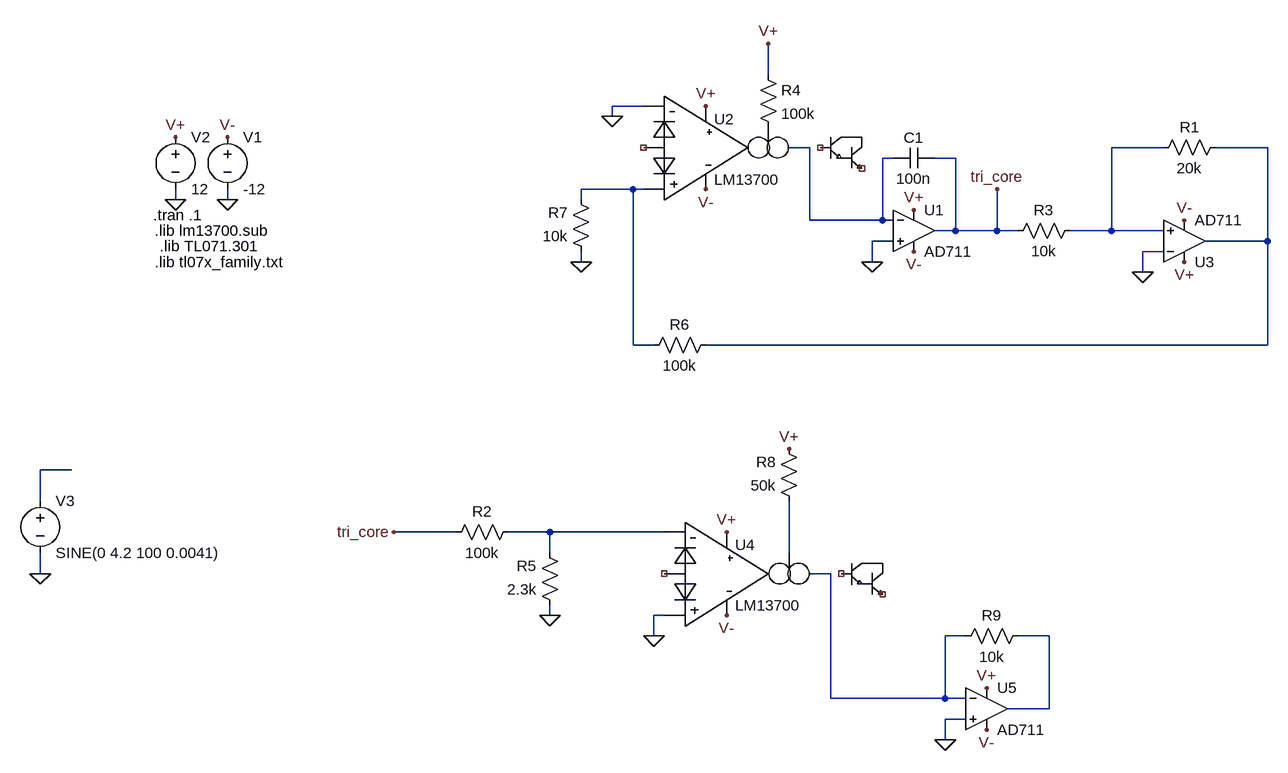
[diagram p0: schematic osc_core.asc]
osc_core.asc, the LTspice schematic file:
Version 4
SHEET 1 1972 1108
WIRE -208 -16 -208 -64
WIRE -400 32 -448 32
WIRE -448 48 -448 32
WIRE -144 96 -176 96
WIRE 400 96 320 96
WIRE 560 96 480 96
WIRE -16 112 -32 112
WIRE 80 112 48 112
WIRE -416 160 -496 160
WIRE -400 160 -416 160
WIRE -1120 176 -1120 160
WIRE -1040 176 -1040 160
WIRE -496 176 -496 160
WIRE -144 208 -144 96
WIRE -32 208 -32 112
WIRE -32 208 -144 208
WIRE -16 208 -32 208
WIRE 80 224 80 112
WIRE 80 224 48 224
WIRE 144 224 144 160
WIRE 144 224 80 224
WIRE 176 224 144 224
WIRE 320 224 320 96
WIRE 320 224 256 224
WIRE 400 224 320 224
WIRE -16 240 -48 240
WIRE 560 240 560 96
WIRE 560 240 464 240
WIRE 400 256 368 256
WIRE -496 272 -496 256
WIRE -48 272 -48 240
WIRE 368 288 368 256
WIRE -416 400 -416 160
WIRE -384 400 -416 400
WIRE 560 400 560 240
WIRE 560 400 -304 400
WIRE -1280 592 -1328 592
WIRE -1328 640 -1328 592
WIRE -688 688 -784 688
WIRE -544 688 -608 688
WIRE -368 688 -544 688
WIRE -544 720 -544 688
WIRE -176 720 -176 640
WIRE -1328 752 -1328 720
WIRE -112 752 -144 752
WIRE -544 816 -544 800
WIRE -368 816 -384 816
WIRE -384 848 -384 816
WIRE 96 848 64 848
WIRE 224 848 176 848
WIRE -112 944 -112 752
WIRE 64 944 64 848
WIRE 64 944 -112 944
WIRE 96 944 64 944
WIRE 224 960 224 848
WIRE 224 960 160 960
WIRE 96 976 64 976
WIRE 64 1008 64 976
FLAG -1040 176 0
FLAG -1120 176 0
FLAG -1120 80 V+
FLAG 432 272 V+
FLAG -1040 80 V-
FLAG 432 208 V-
FLAG -208 -64 V+
FLAG -304 32 V+
FLAG -304 160 V-
FLAG -448 48 0
FLAG 368 288 0
FLAG 16 192 V+
FLAG 16 256 V-
FLAG -48 272 0
FLAG -496 272 0
FLAG 144 160 tri_core
FLAG -784 688 tri_core
FLAG -384 848 0
FLAG -544 816 0
FLAG -176 560 V+
FLAG -272 816 V-
FLAG -272 688 V+
FLAG 128 992 V-
FLAG 128 928 V+
FLAG 64 1008 0
FLAG -1328 752 0
SYMBOL voltage -1040 64 R0
WINDOW 123 0 0 Left 0
WINDOW 39 0 0 Left 0
SYMATTR InstName V1
SYMATTR Value -12
SYMBOL voltage -1120 64 R0
WINDOW 123 0 0 Left 0
WINDOW 39 0 0 Left 0
SYMATTR InstName V2
SYMATTR Value 12
SYMBOL LM13700 -336 16 R0
SYMATTR InstName U2
SYMBOL res -224 -32 R0
SYMATTR InstName R4
SYMATTR Value 100k
SYMBOL res 496 80 R90
WINDOW 0 0 56 VBottom 2
WINDOW 3 32 56 VTop 2
SYMATTR InstName R1
SYMATTR Value 20k
SYMBOL cap 48 96 R90
WINDOW 0 0 32 VBottom 2
WINDOW 3 32 32 VTop 2
SYMATTR InstName C1
SYMATTR Value 100n
SYMBOL res 272 208 R90
WINDOW 0 0 56 VBottom 2
WINDOW 3 32 56 VTop 2
SYMATTR InstName R3
SYMATTR Value 10k
SYMBOL res -288 384 R90
WINDOW 0 0 56 VBottom 2
WINDOW 3 32 56 VTop 2
SYMATTR InstName R6
SYMATTR Value 100k
SYMBOL res -480 272 R180
WINDOW 0 36 76 Left 2
WINDOW 3 36 40 Left 2
SYMATTR InstName R7
SYMATTR Value 10k
SYMBOL OpAmps\\AD711 16 160 R0
SYMATTR InstName U1
SYMBOL OpAmps\\AD711 432 304 M180
SYMATTR InstName U3
SYMBOL LM13700 -304 672 R0
SYMATTR InstName U4
SYMBOL res -592 672 R90
WINDOW 0 0 56 VBottom 2
WINDOW 3 32 56 VTop 2
SYMATTR InstName R2
SYMATTR Value 100k
SYMBOL res -528 816 R180
WINDOW 0 36 76 Left 2
WINDOW 3 36 40 Left 2
SYMATTR InstName R5
SYMATTR Value 2.3k
SYMBOL res -160 656 R180
WINDOW 0 36 76 Left 2
WINDOW 3 36 40 Left 2
SYMATTR InstName R8
SYMATTR Value 50k
SYMBOL res 192 832 R90
WINDOW 0 0 56 VBottom 2
WINDOW 3 32 56 VTop 2
SYMATTR InstName R9
SYMATTR Value 10k
SYMBOL OpAmps\\AD711 128 896 R0
SYMATTR InstName U5
SYMBOL voltage -1328 624 R0
WINDOW 123 0 0 Left 0
WINDOW 39 0 0 Left 0
SYMATTR InstName V3
SYMATTR Value SINE(0 4.2 100 0.0041)
TEXT -1154 200 Left 2 !.tran .1
TEXT -1152 224 Left 2 !.lib lm13700.sub
TEXT -1144 248 Left 2 !.lib TL071.301
TEXT -1152 272 Left 2 !.lib tl07x_family.txt

The netlist it stands for:
* osc_core.asc
V1 V- 0 -12
V2 V+ 0 12
XU2 NC_01 N004 0 P001 N001 V+ V- NC_02 NC_03 LM13700 HALF13700  ; pins LIN INP INN IAB ? VCC VSS BIN BUF
R4 V+ P001 100k
R1 N003 N002 20k
C1 tri_core N001 100n
R3 N002 tri_core 10k
R6 N003 N004 100k
R7 0 N004 10k
XU1 0 N001 V+ V- tri_core AD712  ; AD711, pins In+ In- V+ V- OUT
XU3 N002 0 V+ V- N003 AD712  ; AD711, pins In+ In- V+ V- OUT
XU4 NC_04 0 N006 N007 N008 V+ V- NC_05 NC_06 LM13700 HALF13700  ; pins LIN INP INN IAB ? VCC VSS BIN BUF
R2 N006 tri_core 100k
R5 0 N006 2.3k
R8 N007 V+ 50k
R9 N009 N008 10k
XU5 0 N008 V+ V- N009 AD712  ; AD711, pins In+ In- V+ V- OUT
V3 N005 0 SINE(0 4.2 100 0.0041)
.tran .1
.lib lm13700.sub
.lib TL071.301
.lib tl07x_family.txt
.lib ADI1.lib
.backanno
.end